# EAGLE design led_board_RGB-final (EAGLE 8.3.1)
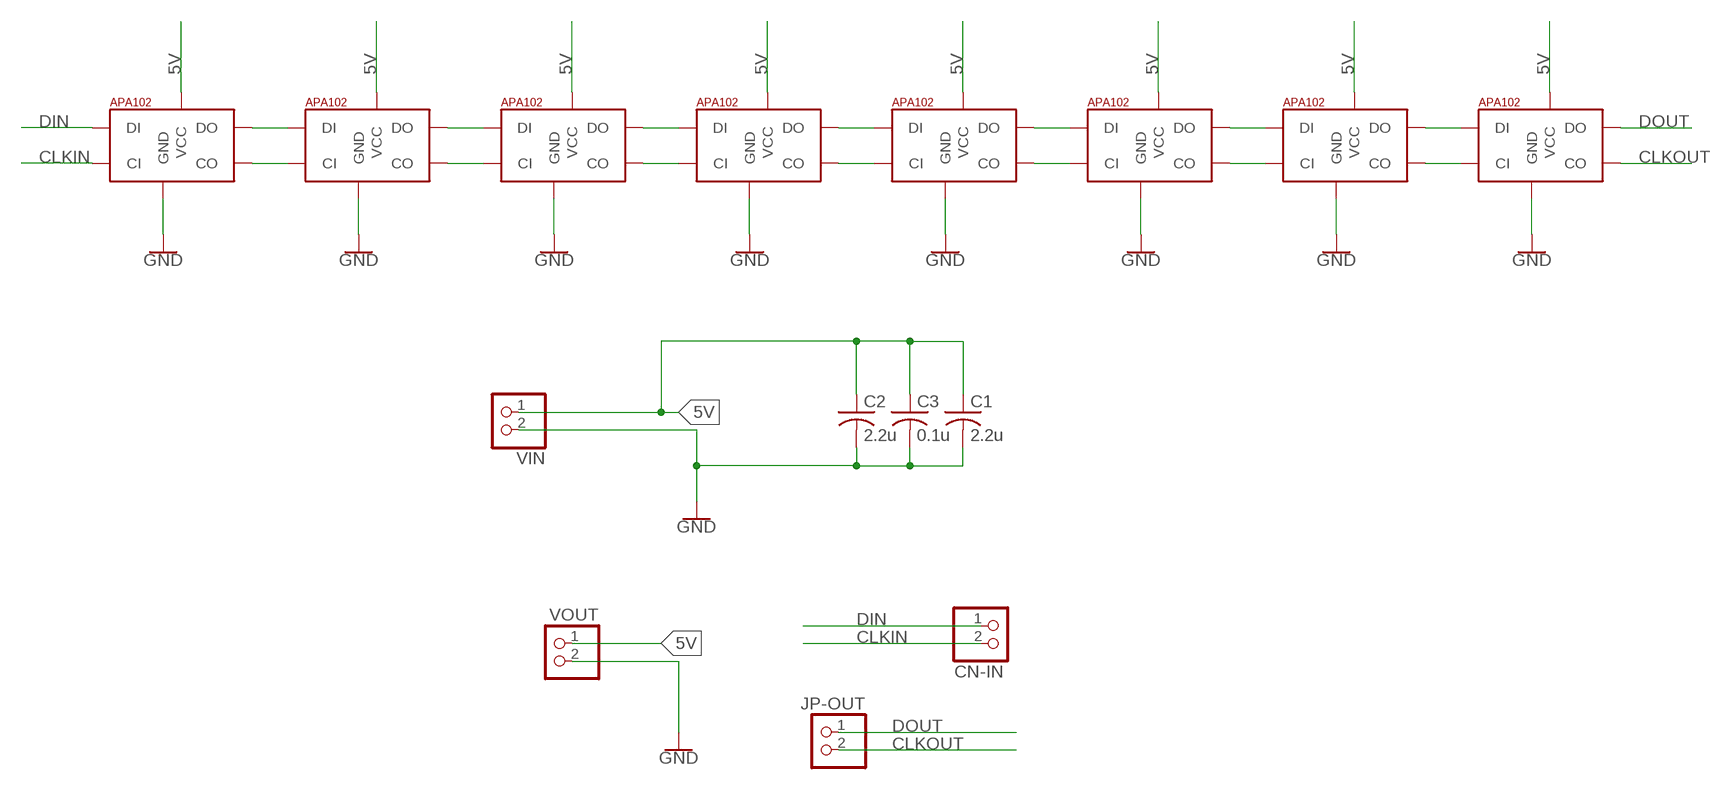
[diagram p0: schematic, sheet 1]

## Parts
C1  2.2u  C-USC1206  [C1206]
C2  2.2u  C-USC1206  [C1206]
C3  0.1u  C-USC0805  [C0805]
CN-IN  JST_2PIN-THM-RA  [JST-PH-2-THM-RA]
JP-OUT  PINHD-1X2  [1X02]
U$1  APA1022020  [APA102_2020]
U$2  APA1022020  [APA102_2020]
U$3  APA1022020  [APA102_2020]
U$4  APA1022020  [APA102_2020]
U$5  APA1022020  [APA102_2020]
U$6  APA1022020  [APA102_2020]
U$7  APA1022020  [APA102_2020]
U$8  APA1022020  [APA102_2020]
VIN  JST_2PIN-THM-RA  [JST-PH-2-THM-RA]
VOUT  PINHD-1X2  [1X02]

## Nets
5V: C1.1 C2.1 C3.1 U$1.V_CC(VCC) U$2.V_CC(VCC) U$3.V_CC(VCC) U$4.V_CC(VCC) U$5.V_CC(VCC) U$6.V_CC(VCC) U$7.V_CC(VCC) U$8.V_CC(VCC) VIN.1 VOUT.1
CLKIN: CN-IN.2 U$1.C_IN(CI)
CLKOUT: JP-OUT.2 U$8.CL_OUT(CO)
DIN: CN-IN.1 U$1.D_IN(DI)
DOUT: JP-OUT.1 U$8.D_OUT(DO)
GND: C1.2 C2.2 C3.2 U$1.GND U$2.GND U$3.GND U$4.GND U$5.GND U$6.GND U$7.GND U$8.GND VIN.2 VOUT.2
N$9: U$1.D_OUT(DO) U$2.D_IN(DI)
N$10: U$1.CL_OUT(CO) U$2.C_IN(CI)
N$11: U$2.D_OUT(DO) U$3.D_IN(DI)
N$12: U$2.CL_OUT(CO) U$3.C_IN(CI)
N$13: U$3.D_OUT(DO) U$4.D_IN(DI)
N$14: U$3.CL_OUT(CO) U$4.C_IN(CI)
N$15: U$4.D_OUT(DO) U$5.D_IN(DI)
N$16: U$4.CL_OUT(CO) U$5.C_IN(CI)
N$17: U$5.D_OUT(DO) U$6.D_IN(DI)
N$18: U$5.CL_OUT(CO) U$6.C_IN(CI)
N$19: U$6.D_OUT(DO) U$7.D_IN(DI)
N$20: U$6.CL_OUT(CO) U$7.C_IN(CI)
N$21: U$7.D_OUT(DO) U$8.D_IN(DI)
N$22: U$7.CL_OUT(CO) U$8.C_IN(CI)

## Library data of the parts
C1-C3 = adafruit:C-US: CAPACITOR, American symbol
CN-IN VIN = adafruit:JST_2PIN: JST 2-Pin Connectors of various flavors SMT-RA (S2B-PH-SM4) 4UConnector #17311 SMT (B2B-PH-SM4) THM-RA (S2B-PH) THM (B2B-PH)
JP-OUT VOUT = pinhead:PINHD-1X2: PIN HEADER
U$1-U$8 = jos-ph:APA102: APA102C 5050 RGB LED -- Adafruit DotStar Single LED Pixel Product Page: https://www.adafruit.com/products/2343 Datasheet: https://cdn-shop.adafruit.com/product-files/2343/APA102C.pdf

## Board
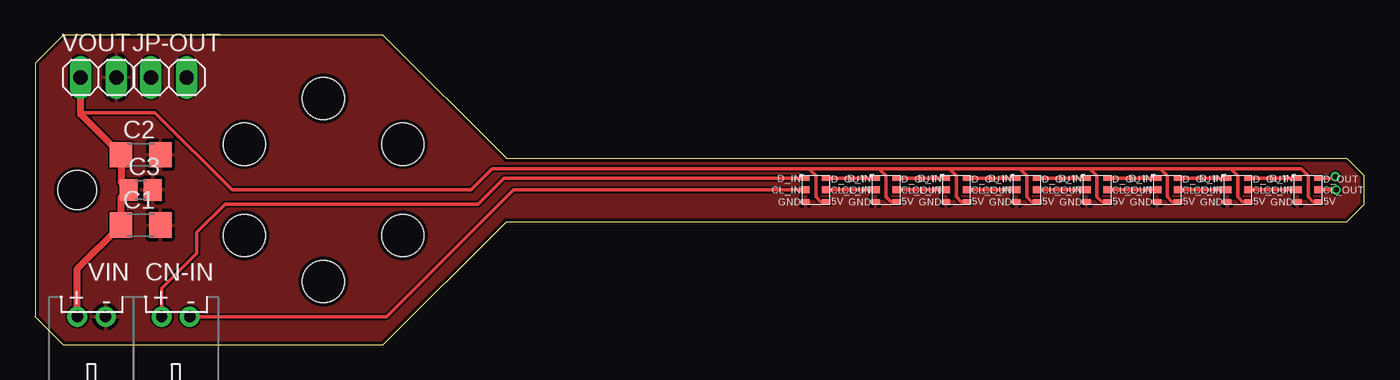
[diagram p1: board, top side]
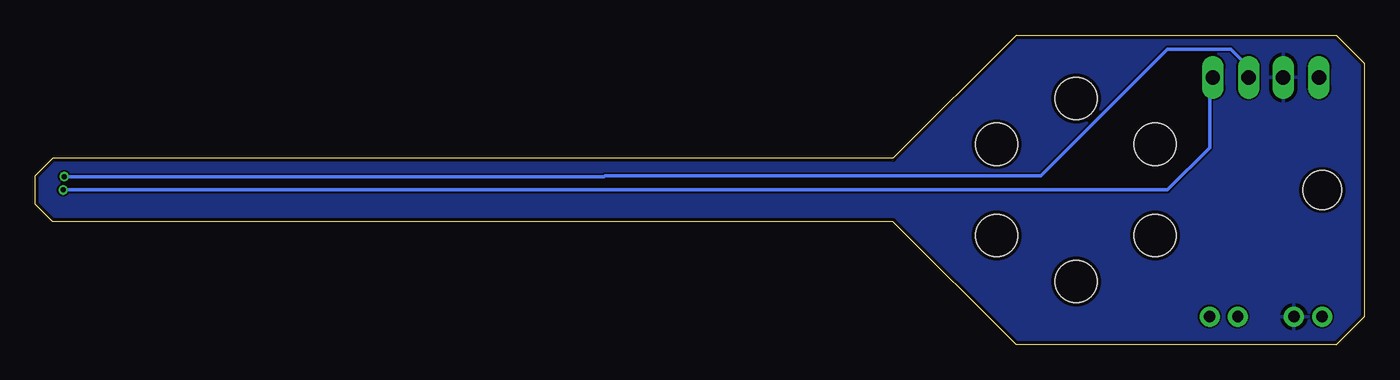
[diagram p2: board, bottom side, seen from below]

Size 94.5 x 22 mm. Coordinates in mm from the lower left corner, seen from the top.
Outline: 2,0 24.75,0 33.5,8.75 93.25,8.75 94.5,10 94.5,12 93.25,13.25 33.5,13.25 24.75,22 2,22 0,20 0,2 2,0
Copper layers (1*16): Top 0.035mm / dielectric 1.5mm / Bottom 0.035mm
Design rules "dirt_cheap_dirty_boards.v1": minimum track width 5mil, minimum drill 12mil, track to track 5mil, track to pad 5mil, pad to pad 5mil, via to via 5mil, smd to smd 0mil, copper to edge 10mil, drill to drill 10mil, minimum pad ring 10mil, minimum via ring 6mil, stop-mask expansion 2mil, vias tented up to drill 25mil, thermal gap 10mil
Holes 3 mm at 20.5,17.5 26.13,7.75 14.87,7.75 20.5,4.5 14.87,14.25 26.13,14.25
Holes 2.75 mm at 3,11

### Footprints (pad centres in the part's own frame; a part is rotated, then mirrored left to right if it is on the bottom)
C1206 = smd 1.6 x 1.8: 1 -1.4,0; 2 1.4,0
C0805 = smd 1.3 x 1.5: 1 -0.85,0; 2 0.85,0
JST-PH-2-THM-RA = drill 0.8 pad 1.422: 1 1,0; 2 -1,0
1X02 = drill 1.016 long: 1 -1.27,0; 2 1.27,0
APA102_2020 = smd 0.6 x 0.5: C_IN 0.25,1; CL_OUT 1.75,1 | smd 0.6 x 0.35: D_IN 0.25,1.825; D_OUT 1.75,1.825; GND 0.25,0.175; V_CC 1.75,0.175

### Placement (x,y rotation side)
C1  7.5,8.5 0 top
C2  7.5,13.5 0 top
C3  7.5,11 0 top
CN-IN  10,2 180 top
JP-OUT  9.5,19 0 top
U$1  54.5,10 0 top
U$2  59.5,10 0 top
U$3  64.5,10 0 top
U$4  69.5,10 0 top
U$5  74.5,10 0 top
U$6  79.5,10 0 top
U$7  84.5,10 0 top
U$8  89.5,10 0 top
VIN  4,2 180 top
VOUT  4.5,19 0 top

### Tracks (layer width: path | path; a pad name or v marks a point on that pad's centre or on a via)
5V
  Top 0.254: U$1.V_CC 55.83,10.18 55.5,10.5 55.5,12 55,12.5 | 55,12.5 32.5,12.5 31,11 14,11 8.5,16.5 3.32,16.5 3.23,16.59 | U$8.V_CC 90.83,10.18 90.5,10.5 90.5,12 90,12.5 85,12.5 | U$2.V_CC 60.83,10.18 60.5,10.5 60.5,12 60,12.5 | 60,12.5 55,12.5 | U$3.V_CC 65.83,10.18 65.5,10.5 65.5,12 65,12.5 | 65,12.5 60,12.5 | U$4.V_CC 70.83,10.18 70.5,10.5 70.5,12 70,12.5 | 70,12.5 65,12.5 | U$5.V_CC 75.83,10.18 75.5,10.5 75.5,12 75,12.5 | 75,12.5 70,12.5 | U$6.V_CC 80.83,10.18 80.5,10.5 80.5,12 80,12.5 | 80,12.5 75,12.5 | U$7.V_CC 85.83,10.18 85.5,10.5 85.5,12 85,12.5 | 85,12.5 80,12.5
  Top 0.508: VIN.1 3,5.4 C1.1 6.1,10.45 C3.1 6.1,11.55 C2.1 3.23,16.37 3.23,16.59 VOUT.1
CLKIN
  Top 0.254: U$1.C_IN 34,11 25,2 CN-IN.2
CLKOUT  (via drill 0.35)
  Top 0.254: U$8.CL_OUT v92.5,11
  Bottom 0.254: v92.5,11 14,11 11,14 11,18.77 JP-OUT.2
DIN
  Top 0.254: U$1.D_IN 33.33,11.82 31.5,10 13.5,10 11.5,8 11.5,6.5 9,4 CN-IN.1
DOUT  (via drill 0.35)
  Top 0.254: v92.43,11.95 92.3,11.82 U$8.D_OUT
  Bottom 0.254: v92.43,11.95 54.05,11.95 54,12 23,12 14,21 9.5,21 8.23,19.73 JP-OUT.1
GND
  pour Top: -7.5,25.5 115.5,25.5 115.5,-6.5 -7.5,-6.5
  pour Bottom: -6,25 110.5,25 110.5,-5 -6,-5
N$9
  Top 0.254: U$1.D_OUT U$2.D_IN
N$10
  Top 0.254: U$2.C_IN U$1.CL_OUT
N$11
  Top 0.254: U$2.D_OUT U$3.D_IN
N$12
  Top 0.254: U$3.C_IN U$2.CL_OUT
N$13
  Top 0.254: U$3.D_OUT U$4.D_IN
N$14
  Top 0.254: U$4.C_IN U$3.CL_OUT
N$15
  Top 0.254: U$4.D_OUT U$5.D_IN
N$16
  Top 0.254: U$5.C_IN U$4.CL_OUT
N$17
  Top 0.254: U$5.D_OUT U$6.D_IN
N$18
  Top 0.254: U$6.C_IN U$5.CL_OUT
N$19
  Top 0.254: U$6.D_OUT U$7.D_IN
N$20
  Top 0.254: U$7.C_IN U$6.CL_OUT
N$21
  Top 0.254: U$7.D_OUT U$8.D_IN
N$22
  Top 0.254: U$7.CL_OUT U$8.C_IN

### Text on the board
Reference: Flipped dout and clkout